# Altium schematic sheet Cyusb3314_Interface.SchDoc
size 401 x 330 mm
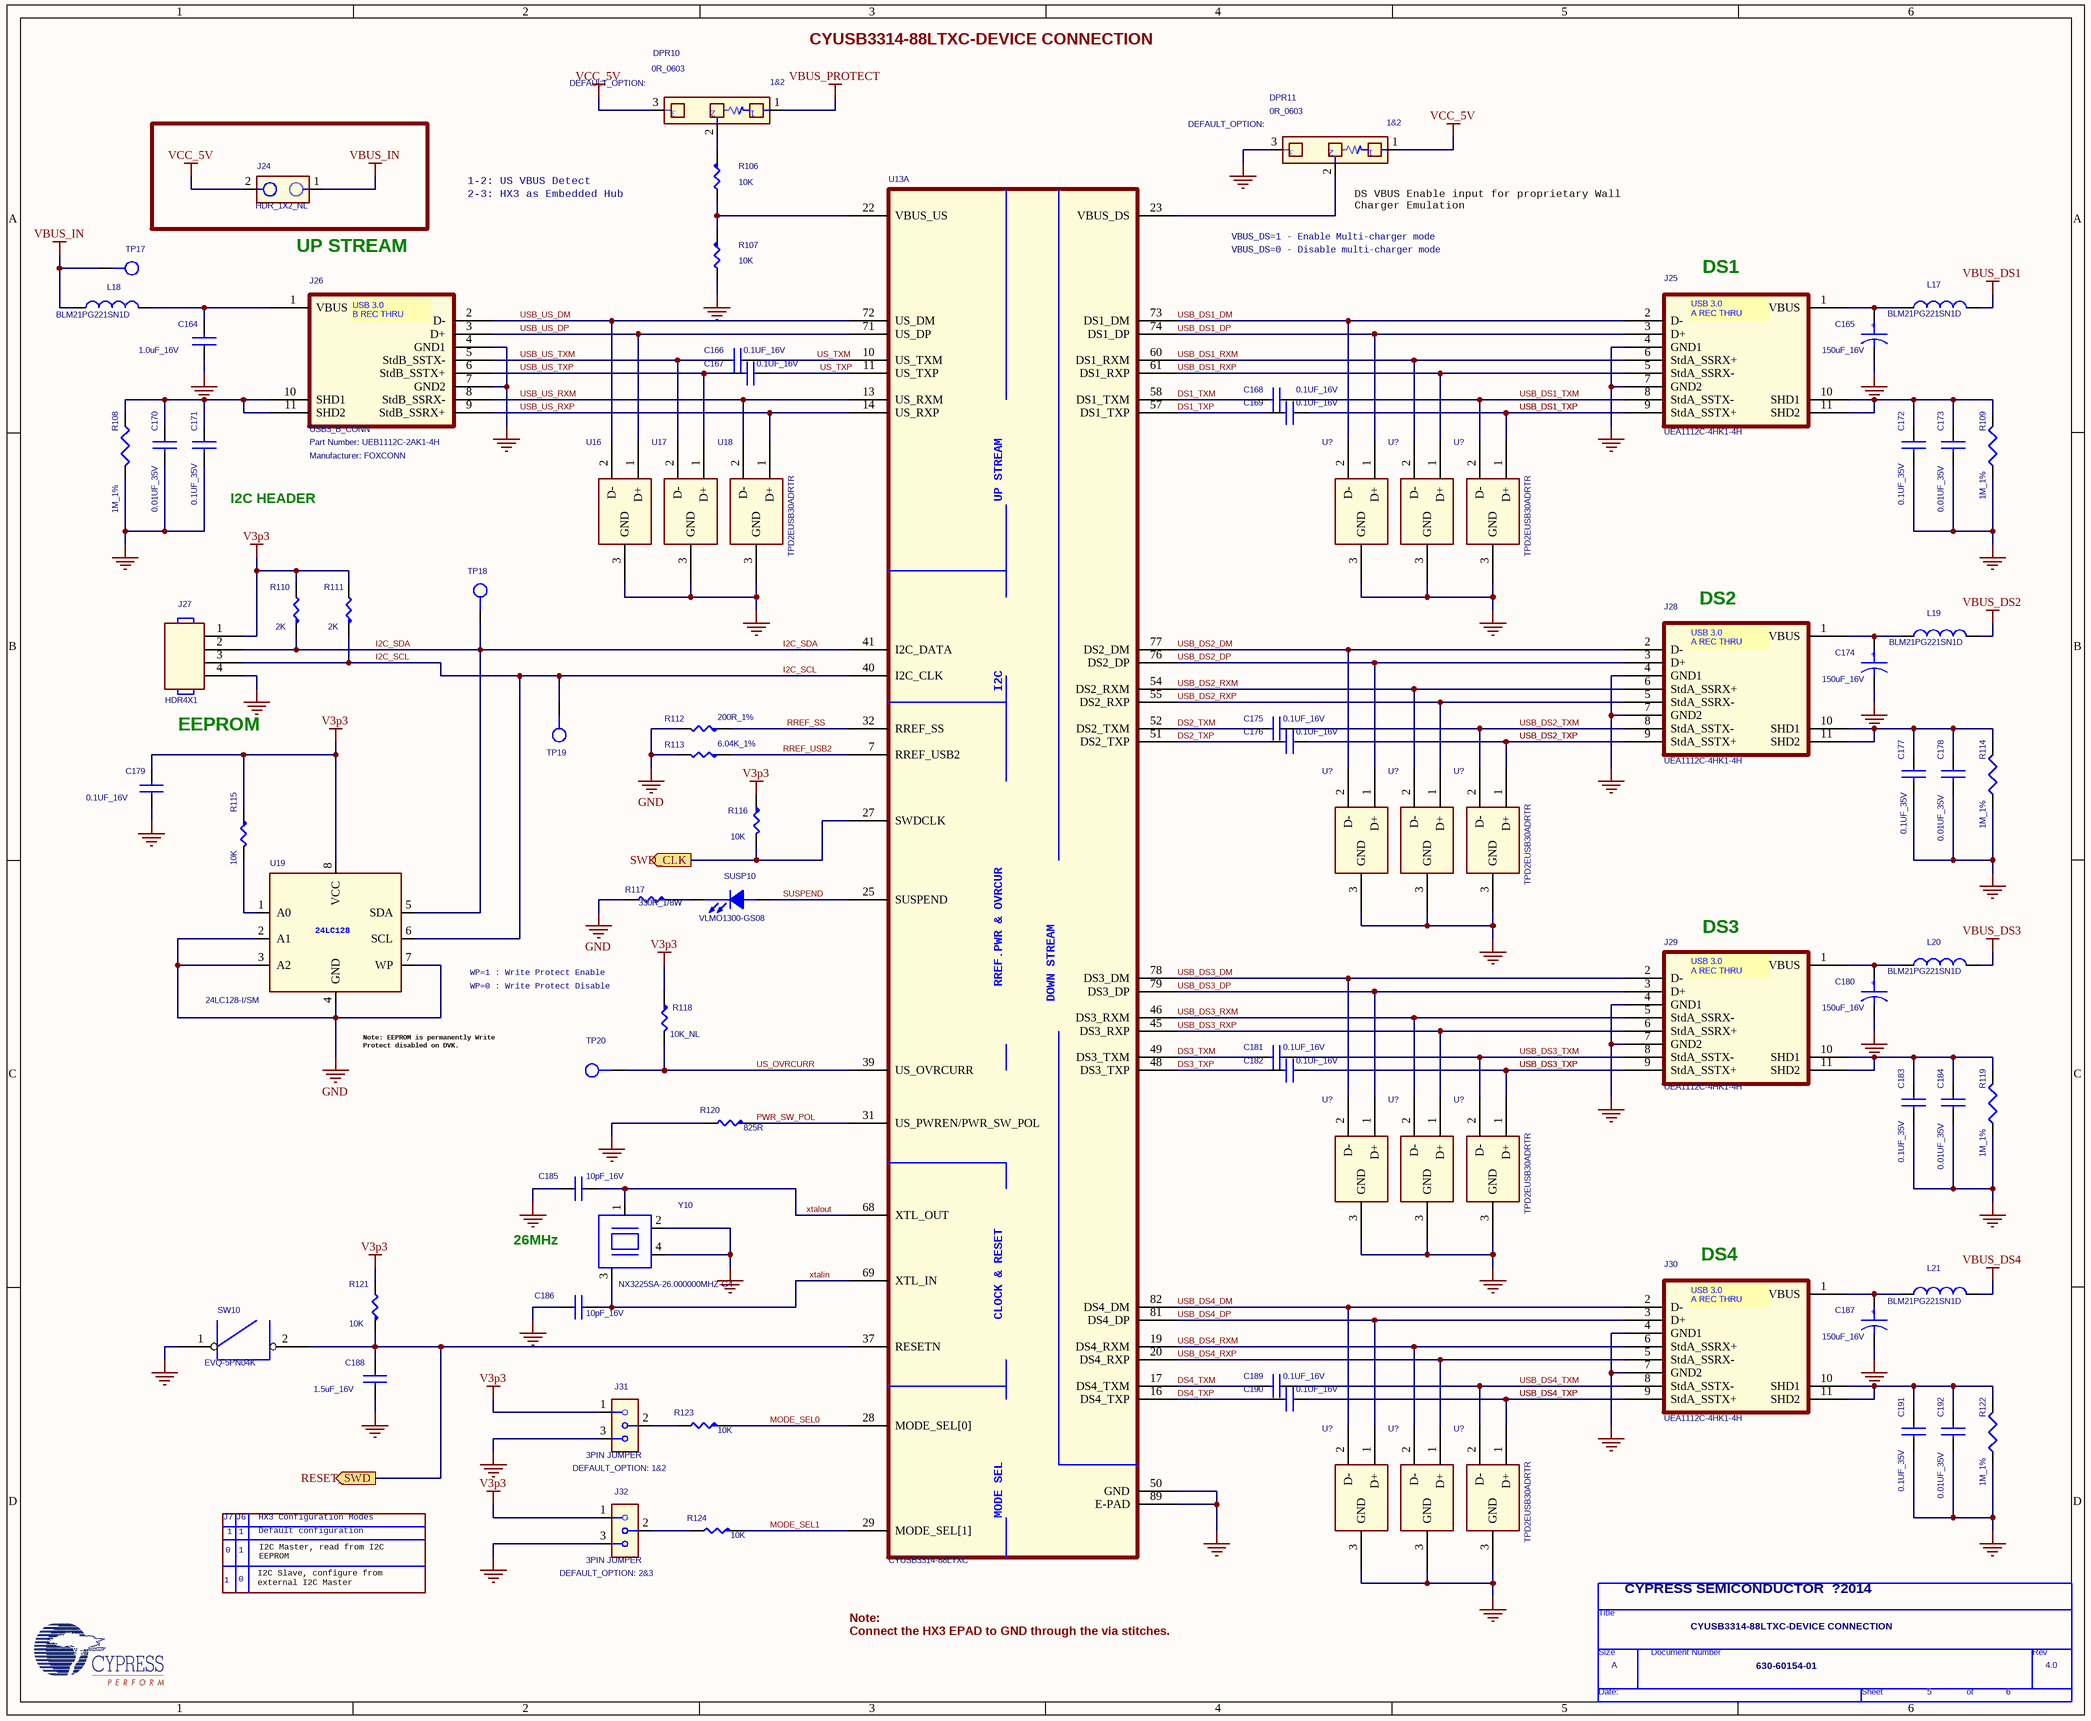
[diagram p0: Cyusb3314_Interface.SchDoc]

## Parts
(Parts that share a designator on the sheet are numbered #1, #2 ... from top to bottom, then left to right.)
*  Page Count: 6  Page Number: 5  Page Size: A  Title: CYUSB3314-88LTXC-DEVICE CONNECTION  RevCode: 4.0  Doc: 630-60154-01  (hidden comment: TitleBlock0)  (graphical)
C164  1.0uF_16V  [CAPC1005X56M]
C165  150uF_16V  [CAPAE660X800M]
C166  0.1UF_16V  [CAPC1005X56M]
C167  0.1UF_16V  [CAPC1005X56M]
C168  0.1UF_16V  [CAPC1005X56M]
C169  0.1UF_16V  [CAPC1005X56M]
C170  0.01UF_35V  [CAPC1005X55M]
C171  0.1UF_35V  [CAPC1005X55M]
C172  0.1UF_35V  [CAPC1005X55M]
C173  0.01UF_35V  [CAPC1005X55M]
C174  150uF_16V  [CAPAE660X800M]
C175  0.1UF_16V  [CAPC1005X56M]
C176  0.1UF_16V  [CAPC1005X56M]
C177  0.1UF_35V  [CAPC1005X55M]
C178  0.01UF_35V  [CAPC1005X55M]
C179  0.1UF_16V  [CAPC1005X56M]
C180  150uF_16V  [CAPAE660X800M]
C181  0.1UF_16V  [CAPC1005X56M]
C182  0.1UF_16V  [CAPC1005X56M]
C183  0.1UF_35V  [CAPC1005X55M]
C184  0.01UF_35V  [CAPC1005X55M]
C185  10pF_16V  [CAPC1608X90M]
C186  10pF_16V  [CAPC1608X90M]
C187  150uF_16V  [CAPAE660X800M]
C188  1.5uF_16V  [CAPC1608X90M]
C189  0.1UF_16V  [CAPC1005X56M]
C190  0.1UF_16V  [CAPC1005X56M]
C191  0.1UF_35V  [CAPC1005X55M]
C192  0.01UF_35V  [CAPC1005X55M]
DPR10  0R_0603  Mounting Status: 1&2  [RC0603_3P]
DPR11  0R_0603  Mounting Status: 1&2  [RC0603_3P]
J24  HDR_1X2_NL  [SAMTEC_TSW-102-08-G-S]
J25  UEA1112C-4HK1-4H  [FOXCONN_UEA1112C-4HK1-4H]
J26  USB3_B_CONN  Manufacturer: FOXCONN  [FOXCONN_UEB1112C-2AK1-4H]
J27  HDR4X1  [SAMTEC_TSW-104-08-G-S]
J28  UEA1112C-4HK1-4H  [FOXCONN_UEA1112C-4HK1-4H]
J29  UEA1112C-4HK1-4H  [FOXCONN_UEA1112C-4HK1-4H]
J30  UEA1112C-4HK1-4H  [FOXCONN_UEA1112C-4HK1-4H]
J31  3PIN JUMPER  DEFAULT_OPTION: 1&2  [TE_3-644456-3]
J32  3PIN JUMPER  DEFAULT_OPTION: 2&3  [TE_3-644456-3]
L17  BLM21PG221SN1D  [INDC2012X105M]
L18  BLM21PG221SN1D  [INDC2012X105M]
L19  BLM21PG221SN1D  [INDC2012X105M]
L20  BLM21PG221SN1D  [INDC2012X105M]
L21  BLM21PG221SN1D  [INDC2012X105M]
R106  10K  [RESC1005X40M]
R107  10K  [RESC1005X40M]
R108  1M_1%  [RESC1608X55M]
R109  1M_1%  [RESC1608X55M]
R110  2K  [RESC1608X55M]
R111  2K  [RESC1608X55M]
R112  200R_1%  [RESC1608X50M]
R113  6.04K_1%  [RESC1608X55M_A]
R114  1M_1%  [RESC1608X55M]
R115  10K  [RESC1608X55M]
R116  10K  [RESC1005X40M]
R117  330R_1/8W  [RESC1608X50M]
R118  10K_NL  [RESC1005X40M]
R119  1M_1%  [RESC1608X55M]
R120  825R  [RESC1005X40M]
R121  10K  [RESC1608X55M]
R122  1M_1%  [RESC1608X55M]
R123  10K  [RESC1005X40M]
R124  10K  [RESC1005X40M]
SUSP10  VLMO1300-GS08  [LEDC1608X80M]
SW10  EVQ-5PN04K  [SW_EVQ-5PN04K]
TP17  TP_RED  [KEYSTONE_5000]  (value not drawn)
TP18  TP_YEL  [KEYSTONE_5000]  (value not drawn)
TP19  TP_YEL  [KEYSTONE_5000]  (value not drawn)
TP20  TP_YEL  [KEYSTONE_5000]  (value not drawn)
U13  CYUSB3314-88LTXC  [QFN40P1000X1000X100-89M]  (part A of 3)
U16  TPD2EUSB30ADRTR  [SOTFL35P100X50-3M]  (value not drawn)
U17  TPD2EUSB30ADRTR  [SOTFL35P100X50-3M]  (value not drawn)
U18  TPD2EUSB30ADRTR  [SOTFL35P100X50-3M]
U19  24LC128-I/SM  [SOIC127P790X203-8M]
U?#1  TPD2EUSB30ADRTR  [SOTFL35P100X50-3M]  (value not drawn)
U?#2  TPD2EUSB30ADRTR  [SOTFL35P100X50-3M]  (value not drawn)
U?#3  TPD2EUSB30ADRTR  [SOTFL35P100X50-3M]
U?#4  TPD2EUSB30ADRTR  [SOTFL35P100X50-3M]  (value not drawn)
U?#5  TPD2EUSB30ADRTR  [SOTFL35P100X50-3M]  (value not drawn)
U?#6  TPD2EUSB30ADRTR  [SOTFL35P100X50-3M]
U?#7  TPD2EUSB30ADRTR  [SOTFL35P100X50-3M]  (value not drawn)
U?#8  TPD2EUSB30ADRTR  [SOTFL35P100X50-3M]  (value not drawn)
U?#9  TPD2EUSB30ADRTR  [SOTFL35P100X50-3M]
U?#10  TPD2EUSB30ADRTR  [SOTFL35P100X50-3M]  (value not drawn)
U?#11  TPD2EUSB30ADRTR  [SOTFL35P100X50-3M]  (value not drawn)
U?#12  TPD2EUSB30ADRTR  [SOTFL35P100X50-3M]
Y10  NX3225SA-26.000000MHZ-G4  [OSCCC250X320X70-4M]

## Ports
RESET_SWD (out), SWD_CLK (out)

## Nets
GND: C164.1 C165.2 C170.2 C171.2 C172.2 C173.2 C174.2 C177.2 C178.2 C179.1 C180.2 C183.2 C184.2 C185.1 C186.1 C187.2 C188.2 C191.2 C192.2 DPR11.3 J25.4(GND1) J25.7(GND2) J26.4(GND1) J26.7(GND2) J27.4 J28.4(GND1) J28.7(GND2) J29.4(GND1) J29.7(GND2) J30.4(GND1) J30.7(GND2) J31.3 J32.3 R107.2 R108.2 R109.2 R112.2 R113.2 R114.2 R117.2 R119.2 R120.2 R122.2 SW10.1 U13.50(GND) U13.89(E-PAD) U16.3(GND) U17.3(GND) U18.3(GND) U19.2(A1) U19.3(A2) U19.4(GND) U19.7(WP) U?#1.3(GND) U?#2.3(GND) U?#3.3(GND) U?#4.3(GND) U?#5.3(GND) U?#6.3(GND) U?#7.3(GND) U?#8.3(GND) U?#9.3(GND) U?#10.3(GND) U?#11.3(GND) U?#12.3(GND) Y10.2 Y10.4
V3p3: C179.2 J27.1 J31.1 J32.1 R110.2 R111.2 R115.1 R116.1 R118.1 R121.2 U19.8(VCC)
VBUS_DS1: L17.1
VBUS_DS2: L19.1
VBUS_DS3: L20.1
VBUS_DS4: L21.1
VBUS_IN: J24.1 L18.1 TP17.1(TP)
VBUS_PROTECT: DPR10.1
VCC_5V: DPR10.3 DPR11.1 J24.2
DS1_TXM: C168.2 U13.58(DS1_TXM)
DS1_TXP: C169.2 U13.57(DS1_TXP)
DS2_TXM: C175.2 U13.52(DS2_TXM)
DS2_TXP: C176.2 U13.51(DS2_TXP)
DS3_TXM: C181.2 U13.49(DS3_TXM)
DS3_TXP: C182.2 U13.48(DS3_TXP)
DS4_TXM: C189.2 U13.17(DS4_TXM)
DS4_TXP: C190.2 U13.16(DS4_TXP)
I2C_SCL: J27.3 R111.1 TP19.1(TP) U13.40(I2C_CLK) U19.6(SCL)
I2C_SDA: J27.2 R110.1 TP18.1(TP) U13.41(I2C_DATA) U19.5(SDA)
MODE_SEL0: R123.1 U13.28(MODE_SEL[0])
MODE_SEL1: R124.1 U13.29(MODE_SEL[1])
PWR_SW_POL: R120.1 U13.31(US_PWREN/PWR_SW_POL)
RESET_SWD: C188.1 R121.1 SW10.2 U13.37(RESETN) ; port RESET_SWD
RREF_SS: R112.1 U13.32(RREF_SS)
RREF_USB2: R113.1 U13.7(RREF_USB2)
SUSPEND: SUSP10.1(ANODE) U13.25(SUSPEND)
SWD_CLK: R116.2 U13.27(SWDCLK) ; port SWD_CLK
US_OVRCURR: R118.2 TP20.1(TP) U13.39(US_OVRCURR)
US_TXM: C166.1 U13.10(US_TXM)
US_TXP: C167.1 U13.11(US_TXP)
USB_DS1_DM: J25.2(D-) U13.73(DS1_DM) U?#1.2(D-)
USB_DS1_DP: J25.3(D+) U13.74(DS1_DP) U?#1.1(D+)
USB_DS1_RXM: J25.6(StdA_SSRX+) U13.60(DS1_RXM) U?#2.2(D-)
USB_DS1_RXP: J25.5(StdA_SSRX-) U13.61(DS1_RXP) U?#2.1(D+)
USB_DS1_TXM: C168.1 J25.8(StdA_SSTX-) U?#3.2(D-)
USB_DS1_TXP: C169.1 J25.9(StdA_SSTX+) U?#3.1(D+)
USB_DS2_DM: J28.2(D-) U13.77(DS2_DM) U?#4.2(D-)
USB_DS2_DP: J28.3(D+) U13.76(DS2_DP) U?#4.1(D+)
USB_DS2_RXM: J28.6(StdA_SSRX+) U13.54(DS2_RXM) U?#5.2(D-)
USB_DS2_RXP: J28.5(StdA_SSRX-) U13.55(DS2_RXP) U?#5.1(D+)
USB_DS2_TXM: C175.1 J28.8(StdA_SSTX-) U?#6.2(D-)
USB_DS2_TXP: C176.1 J28.9(StdA_SSTX+) U?#6.1(D+)
USB_DS3_DM: J29.2(D-) U13.78(DS3_DM) U?#7.2(D-)
USB_DS3_DP: J29.3(D+) U13.79(DS3_DP) U?#7.1(D+)
USB_DS3_RXM: J29.5(StdA_SSRX-) U13.46(DS3_RXM) U?#8.2(D-)
USB_DS3_RXP: J29.6(StdA_SSRX+) U13.45(DS3_RXP) U?#8.1(D+)
USB_DS3_TXM: C181.1 J29.8(StdA_SSTX-) U?#9.2(D-)
USB_DS3_TXP: C182.1 J29.9(StdA_SSTX+) U?#9.1(D+)
USB_DS4_DM: J30.2(D-) U13.82(DS4_DM) U?#10.2(D-)
USB_DS4_DP: J30.3(D+) U13.81(DS4_DP) U?#10.1(D+)
USB_DS4_RXM: J30.6(StdA_SSRX+) U13.19(DS4_RXM) U?#11.2(D-)
USB_DS4_RXP: J30.5(StdA_SSRX-) U13.20(DS4_RXP) U?#11.1(D+)
USB_DS4_TXM: C189.1 J30.8(StdA_SSTX-) U?#12.2(D-)
USB_DS4_TXP: C190.1 J30.9(StdA_SSTX+) U?#12.1(D+)
USB_US_DM: J26.2(D-) U13.72(US_DM) U16.2(D-)
USB_US_DP: J26.3(D+) U13.71(US_DP) U16.1(D+)
USB_US_RXM: J26.8(StdB_SSRX-) U13.13(US_RXM) U18.2(D-)
USB_US_RXP: J26.9(StdB_SSRX+) U13.14(US_RXP) U18.1(D+)
USB_US_TXM: C166.2 J26.5(StdB_SSTX-) U17.2(D-)
USB_US_TXP: C167.2 J26.6(StdB_SSTX+) U17.1(D+)
xtalin: C186.2 U13.69(XTL_IN) Y10.3
xtalout: C185.2 U13.68(XTL_OUT) Y10.1
NetC164_2: C164.2 J26.1(VBUS) L18.2
NetC165_1: C165.1 J25.1(VBUS) L17.2
NetC170_1: C170.1 C171.1 J26.10(SHD1) J26.11(SHD2) R108.1
NetC172_1: C172.1 C173.1 J25.10(SHD1) J25.11(SHD2) R109.1
NetC174_1: C174.1 J28.1(VBUS) L19.2
NetC177_1: C177.1 C178.1 J28.10(SHD1) J28.11(SHD2) R114.1
NetC180_1: C180.1 J29.1(VBUS) L20.2
NetC183_1: C183.1 C184.1 J29.10(SHD1) J29.11(SHD2) R119.1
NetC187_1: C187.1 J30.1(VBUS) L21.2
NetC191_1: C191.1 C192.1 J30.10(SHD1) J30.11(SHD2) R122.1
NetDPR10_2: DPR10.2 R106.1
NetDPR11_2: DPR11.2 U13.23(VBUS_DS)
NetJ31_2: J31.2 R123.2
NetJ32_2: J32.2 R124.2
NetR106_2: R106.2 R107.1 U13.22(VBUS_US)
NetR115_2: R115.2 U19.1(A0)
NetR117_1: R117.1 SUSP10.2(CATHODE)

## Notes on the sheet
- CYUSB3314-88LTXC-DEVICE CONNECTION
- 1-2: US VBUS Detect
- 2-3: HX3 as Embedded Hub
- (near DPR11) DS VBUS Enable input for proprietary Wall
  Charger Emulation
- UP STREAM
- VBUS_DS=0 - Disable multi-charger mode
- VBUS_DS=1 - Enable Multi-charger mode
- (near J25) DS1
- (near C171) I2C HEADER
- (near J28) DS2
- EEPROM
- (near J29) DS3
- WP=1 : Write Protect Enable
- WP=0 : Write Protect Disable
- Note: EEPROM is permanently Write
  Protect disabled on DVK.
- 26MHz
- (near J30) DS4
- J7
- 1
- J6
- HX3 Configuration Modes
- Default configuration
- 0
- I2C Slave, configure from
  external I2C Master
- I2C Master, read from I2C
  EEPROM
- (near *) CYPRESS SEMICONDUCTOR  ?2014
- Note:
  Connect the HX3 EPAD to GND through the via stitches.
- (in symbol CAP POL) +
- (in symbol CYUSB3314-88LTXC_2, part A) UP STREAM; I2C; RREF.PWR & OVRCUR; DOWN STREAM; CLOCK & RESET; MODE SEL
- (in symbol TitleBlock0) Title; Size; Document Number; Rev; Date:; Sheet; of
- (in symbol UEA1112C-4HK1-4H) USB 3.0 / A REC THRU
- (in symbol UEA1112C_TX) USB 3.0 / A REC THRU
- (in symbol UEB1112C-2AK1-4H) USB 3.0 / B REC THRU

## Library data of the parts
C164 C166-C169 C175 C176 C179 C181 C182 C185 C186 C189 C190 = CAPACITOR NON-POL
  C164 C175 C176 C189 C190: Manufacturer: *; Part Number: *
  C181: Manufacturer: *
C165 C174 C180 C187 = CAP POL: CAP ALUM 150UF 16V 20% SMD; Part Number: EEE-FK1C151XP; Manufacturer: Panasonic Electronic Components; Lead Free: YES
C170 C173 C178 C184 C192 = CAPACITOR NON-POL: Part Number: C1005X7R1V103M050BB; Manufacturer: *
C171 C172 C177 C183 C191 = CAPACITOR NON-POL: Part Number: C1005X7R1V104K050BB
  C172 C177 C183 C191: Manufacturer: *
C188 = CAPACITOR NON-POL: CAP CER 1.5UF 10V 10% X7R 0805; Manufacturer: TDK Corporation; Lead Free: YES
DPR10 DPR11 = DPR12_0: Resistor, 4.7K, 0402, 1/10W, 5%; Part Number: ERJ-2GEJ472X
J24 = HEADER_1x2: Manufacturer: Samtec Inc; Part Number: TSW-102-08-G-S; Lead Free: YES
J25 J28 J30 = UEA1112C_TX: 9 Position Right Angle 3.0 USB Connector; Manufacturer: FOXCONN; Part Number: UEA1112C-4HK1-4H; Lead Free: YES
J26 = UEB1112C-2AK1-4H: USB 3.0 B Series Right Angle,T/H 9 Pos; Lead Free: YES; Part Number: UEB1112C-2AK1-4H
J27 = HEADER 4: CONN HEADER 4POS .100" SNGL GOLD; Manufacturer: Samtec Inc; Part Number: TSW-104-08-G-S; Lead Free: YES
J29 = UEA1112C-4HK1-4H: 9 Position Right Angle 3.0 USB Connector; Manufacturer: FOXCONN; Part Number: UEA1112C-4HK1-4H
J31 J32 = 3PIN JUM: CONN HEADER VERT 3POS .100 TIN; Part Number: 3-644456-3; Manufacturer: Tyco Electronics; Type: Single Row,3Pin Header
L17 L19-L21 = INDUCTOR: FERRITE CHIP 220 OHM 2A 0805; Manufacturer: Murata; DEVICE: L3; Part Number: BLM21PG221SN1D; Lead Free: YES
L18 = INDUCTOR: FERRITE CHIP 220 OHM 2A 0805; Manufacturer: Murata; Lead Free: YES; Part Number: BLM21PG221SN1D
R106 = R_Dup1: Manufacturer: Panasonic; Part Number: ERJ-2GE0R00X
R107 = R_Dup1: Part Number: ERJ-2RKF4990X; Manufacturer: Panasonic
R108 = R: RES 1M OHM 1/10W 1% 0603 SMD; Part Number: ERJ-3EKF1004V; Manufacturer: Panasonic
R109 = R: RES 1M OHM 1/10W 1% 0603 SMD; Manufaturer: Panasonic; Part Number: ERJ-3EKF1004V
R110 = R_Dup1: RES 2.00K OHM 1/10W 1% 0603 SMD; Manufacturer: Rohm Semiconductor; Part Number: MCR03EZPFX2001; Lead Free: YES
R111 = R_Dup1: RES 2.00K OHM 1/10W 1% 0603 SMD; Part Number: MCR03EZPFX2001; Manufacturer: Rohm Semiconductor; Lead Free: YES
R112 = R_Dup1: RES 200 OHM 1% 0603 SMD; Manufacturer: Stackpole; Part Number: RNCP0603FTD200R
R113 = R_Dup1: RES 6.04K OHM .25W 1% 0603 SMD; Part Number: CRCW06036K04FKEAHP; Manufacturer: Vishay Dale
R114 = R: RES 1M OHM 1/10W 1% 0603 SMD; Manufacturer: Panasonic; PART_NUMBER: ERJ-3EKF1004V
R115 R118 = R_Dup1: RES 10.0K OHM 1/10W 1% 0603 SMD; Part Number: ERJ-3EKF1002V; Manufacturer: Panasonic - ECG; Lead Free: YES
R116 = R_Dup1: RES 10.0K OHM 1/10W 1% 0603 SMD; Manufacturer: Panasonic - ECG; Part Number: ERJ-3EKF1002V; Lead Free: YES
R117 = R_Dup1: Lead Free: YES
R119 R122 = R: RES 1M OHM 1/10W 1% 0603 SMD; Manufacturer: Panasonic; Part Number: ERJ-3EKF1004V
R120 R123 R124 = R_Dup1: Manufacturer: Panasonic; Part Number: ERJ-2RKF49.9X
R121 = R_Dup1: Part Number: ERJ-2RKF49.9X; Manufacturer: Panasonic
SUSP10 = LED: Part Number: VLMO1300-GS08
SW10 = B3U1000P: Part Number: EVQ-5PN04K
TP17 TP19 = TP: TEST POINT PC MINI .040"D RED; Part Number: 5000; Manufacturer: Keystone
TP18 TP20 = TP: TEST POINT PC MINI .040"D RED; PART_NUMBER: 5000; Manufacturer: Keystone
U13 = CYUSB3314-88LTXC_2: Part Number: CYUSB3314-88LTXC
U19 = 24LC128: IC EEPROM 128KBIT 400KHZ 8SOIC; Manufacturer: Microchip Technology; Lead Free: YES; Part Number: 24LC128-I/SM
Y10 = CRYSTAL_1: Manufacturer: NDK; Part Number: NX3225SA-26.000000MHZ-G4
* = TitleBlock0: Page Create Date: March  8, 1995
U16-U18 U?#1-U?#12 = TPD2EUSB30ADRTR: Part Number: TPD2EUSB30ADRTR